# EAGLE schematic HC16_BUS_BOARD_V1 (EAGLE 6.4)
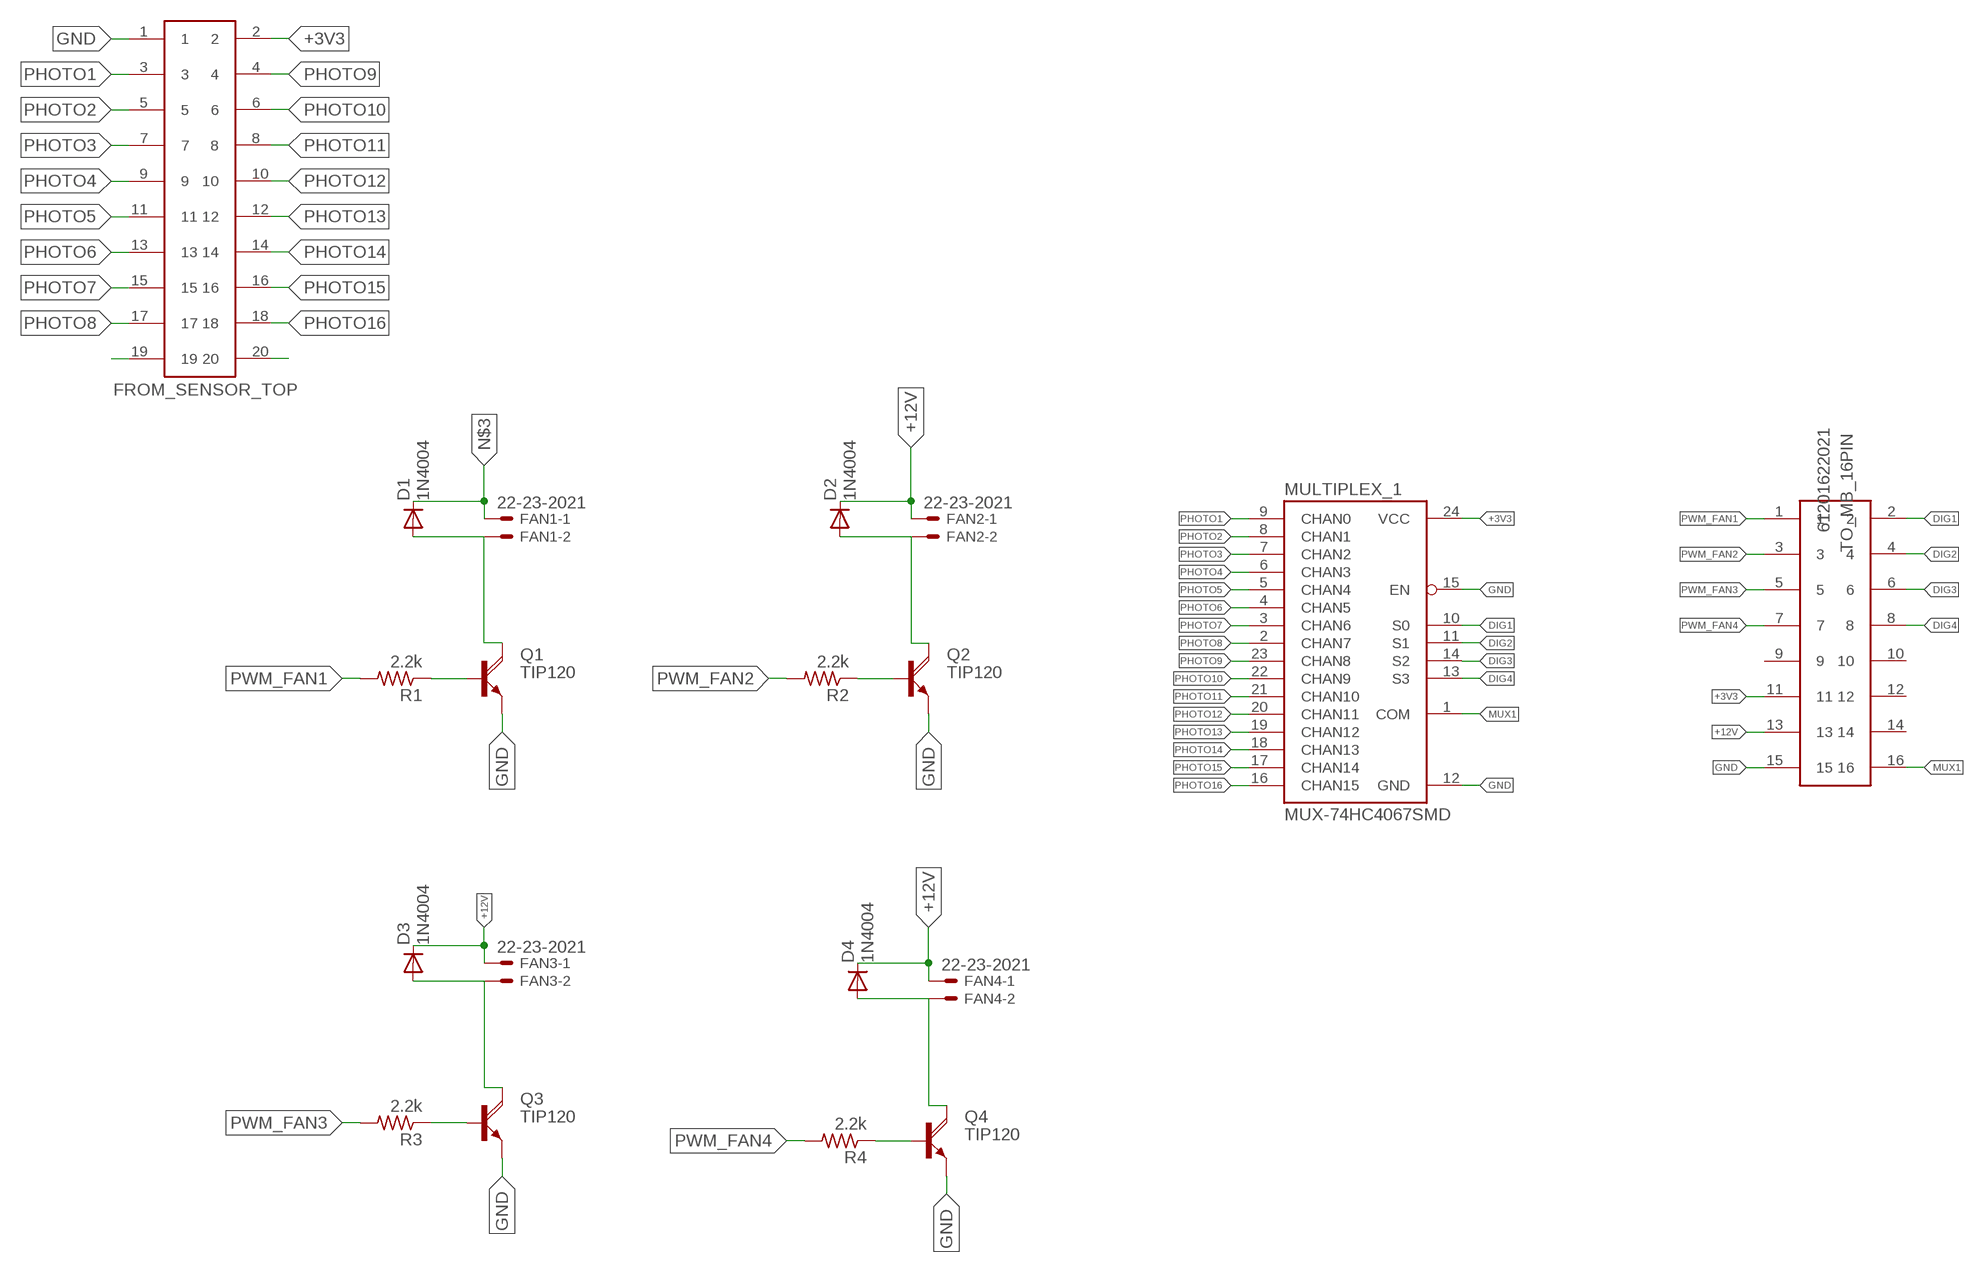
[diagram p0: schematic, sheet 1]

## Parts
D1  1N4004  [DO41-10]
D2  1N4004  [DO41-10]
D3  1N4004  [DO41-10]
D4  1N4004  [DO41-10]
FAN1  22-23-2021  [22-23-2021]
FAN2  22-23-2021  [22-23-2021]
FAN3  22-23-2021  [22-23-2021]
FAN4  22-23-2021  [22-23-2021]
FROM_SENSOR_TOP  61202022021  [61202022021]
MULTIPLEX_1  MUX-74HC4067SMD  [SSOP24]
Q1  TIP120  [TO220AH]
Q2  TIP120  [TO220AH]
Q3  TIP120  [TO220AH]
Q4  TIP120  [TO220AH]
R1  2.2k  R-US_0204/7  [0204/7]
R2  2.2k  R-US_0204/7  [0204/7]
R3  2.2k  R-US_0204/7  [0204/7]
R4  2.2k  R-US_0204/7  [0204/7]
TO_MB_16PIN  61201622021  [61201622021]

## Nets
+3V3: FROM_SENSOR_TOP.2 MULTIPLEX_1.24(VCC) TO_MB_16PIN.11
+12V: D1.C D2.C D3.C FAN1.1 FAN2.1 FAN3.1 TO_MB_16PIN.13
DIG1: MULTIPLEX_1.10(S0) TO_MB_16PIN.2
DIG2: MULTIPLEX_1.11(S1) TO_MB_16PIN.4
DIG3: MULTIPLEX_1.14(S2) TO_MB_16PIN.6
DIG4: MULTIPLEX_1.13(S3) TO_MB_16PIN.8
GND: FROM_SENSOR_TOP.1 MULTIPLEX_1.12(GND) MULTIPLEX_1.15(EN) Q1.E Q2.E Q3.E Q4.E TO_MB_16PIN.15
MUX1: MULTIPLEX_1.1(COM) TO_MB_16PIN.16
N$1: D1.A FAN1.2 Q1.C
N$2: D2.A FAN2.2 Q2.C
N$4: Q1.B R1.1
N$5: Q2.B R2.1
N$6: D3.A FAN3.2 Q3.C
N$7: D4.A FAN4.2 Q4.C
N$8: D4.C FAN4.1
N$10: Q4.B R4.1
N$13: Q3.B R3.1
N$26: FROM_SENSOR_TOP.19
N$27: FROM_SENSOR_TOP.20
PHOTO1: FROM_SENSOR_TOP.3 MULTIPLEX_1.9(CHAN0)
PHOTO2: FROM_SENSOR_TOP.5 MULTIPLEX_1.8(CHAN1)
PHOTO3: FROM_SENSOR_TOP.7 MULTIPLEX_1.7(CHAN2)
PHOTO4: FROM_SENSOR_TOP.9 MULTIPLEX_1.6(CHAN3)
PHOTO5: FROM_SENSOR_TOP.11 MULTIPLEX_1.5(CHAN4)
PHOTO6: FROM_SENSOR_TOP.13 MULTIPLEX_1.4(CHAN5)
PHOTO7: FROM_SENSOR_TOP.15 MULTIPLEX_1.3(CHAN6)
PHOTO8: FROM_SENSOR_TOP.17 MULTIPLEX_1.2(CHAN7)
PHOTO9: FROM_SENSOR_TOP.4 MULTIPLEX_1.23(CHAN8)
PHOTO10: FROM_SENSOR_TOP.6 MULTIPLEX_1.22(CHAN9)
PHOTO11: FROM_SENSOR_TOP.8 MULTIPLEX_1.21(CHAN10)
PHOTO12: FROM_SENSOR_TOP.10 MULTIPLEX_1.20(CHAN11)
PHOTO13: FROM_SENSOR_TOP.12 MULTIPLEX_1.19(CHAN12)
PHOTO14: FROM_SENSOR_TOP.14 MULTIPLEX_1.18(CHAN13)
PHOTO15: FROM_SENSOR_TOP.16 MULTIPLEX_1.17(CHAN14)
PHOTO16: FROM_SENSOR_TOP.18 MULTIPLEX_1.16(CHAN15)
PWM_FAN1: R1.2 TO_MB_16PIN.1
PWM_FAN2: R2.2 TO_MB_16PIN.3
PWM_FAN3: R3.2 TO_MB_16PIN.5
PWM_FAN4: R4.2 TO_MB_16PIN.7
Unconnected: TO_MB_16PIN.9 TO_MB_16PIN.10 TO_MB_16PIN.12 TO_MB_16PIN.14

## Library data of the parts
D1-D4 = diode:1N4004: DIODE general purpose rectifier, 1 A
FAN1-FAN4 = con-molex:22-23-2021: .100" (2.54mm) Center Header - 2 Pin; MF: MOLEX; MPN: 22-23-2021; OC_FARNELL: 1462926; OC_NEWARK: 25C3832
FROM_SENSOR_TOP = Wuerth_Elektronik_eiCan_05_Box_Header_IDC_Connectors_1_2:61202022021: WR-BHD 2.54mm Male Box Header With Lever, 20 Pins
MULTIPLEX_1 = SparkFun-AnalogIC:MUX-74HC4067: 16-channel analog MUX
Q1-Q4 = transistor-power:TIP120: NPN DARLINGTON TRANSISTOR
R1-R4 = rcl:R-US_: RESISTOR, American symbol
TO_MB_16PIN = Wuerth_Elektronik_eiCan_05_Box_Header_IDC_Connectors_1_2:61201622021: WR-BHD 2.54mm Male Box Header With Lever, 16 Pins